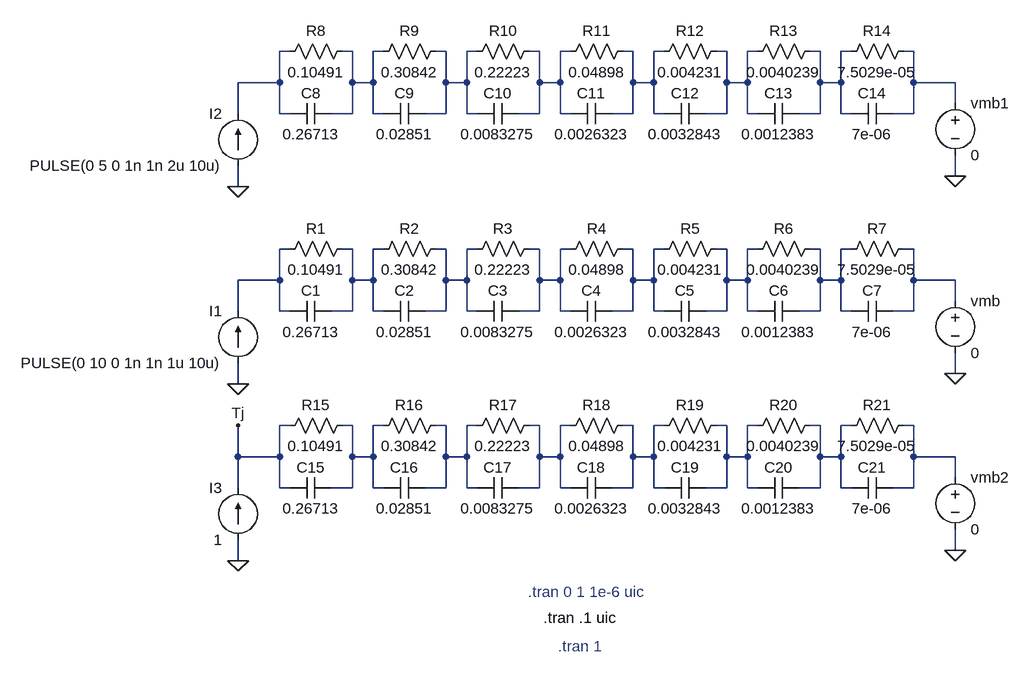
[diagram p0: schematic foster_test.asc]
foster_test.asc, the LTspice schematic file:
Version 4
SHEET 1 1228 1160
WIRE 48 112 32 112
WIRE 144 112 128 112
WIRE 192 112 176 112
WIRE 288 112 272 112
WIRE 336 112 320 112
WIRE 432 112 416 112
WIRE 480 112 464 112
WIRE 576 112 560 112
WIRE 624 112 608 112
WIRE 720 112 704 112
WIRE 768 112 752 112
WIRE 864 112 848 112
WIRE 912 112 896 112
WIRE 1008 112 992 112
WIRE 32 160 32 112
WIRE 32 160 -32 160
WIRE 144 160 144 112
WIRE 176 160 176 112
WIRE 176 160 144 160
WIRE 288 160 288 112
WIRE 320 160 320 112
WIRE 320 160 288 160
WIRE 432 160 432 112
WIRE 464 160 464 112
WIRE 464 160 432 160
WIRE 576 160 576 112
WIRE 608 160 608 112
WIRE 608 160 576 160
WIRE 720 160 720 112
WIRE 752 160 752 112
WIRE 752 160 720 160
WIRE 864 160 864 112
WIRE 896 160 896 112
WIRE 896 160 864 160
WIRE 1008 160 1008 112
WIRE 1072 160 1008 160
WIRE 1072 192 1072 160
WIRE -32 208 -32 160
WIRE 32 208 32 160
WIRE 48 208 32 208
WIRE 144 208 144 160
WIRE 144 208 112 208
WIRE 176 208 176 160
WIRE 192 208 176 208
WIRE 288 208 288 160
WIRE 288 208 256 208
WIRE 320 208 320 160
WIRE 336 208 320 208
WIRE 432 208 432 160
WIRE 432 208 400 208
WIRE 464 208 464 160
WIRE 480 208 464 208
WIRE 576 208 576 160
WIRE 576 208 544 208
WIRE 608 208 608 160
WIRE 624 208 608 208
WIRE 720 208 720 160
WIRE 720 208 688 208
WIRE 752 208 752 160
WIRE 768 208 752 208
WIRE 864 208 864 160
WIRE 864 208 832 208
WIRE 896 208 896 160
WIRE 912 208 896 208
WIRE 1008 208 1008 160
WIRE 1008 208 976 208
WIRE 1072 304 1072 272
WIRE -32 320 -32 288
WIRE 48 416 32 416
WIRE 144 416 128 416
WIRE 192 416 176 416
WIRE 288 416 272 416
WIRE 336 416 320 416
WIRE 432 416 416 416
WIRE 480 416 464 416
WIRE 576 416 560 416
WIRE 624 416 608 416
WIRE 720 416 704 416
WIRE 768 416 752 416
WIRE 864 416 848 416
WIRE 912 416 896 416
WIRE 1008 416 992 416
WIRE 32 464 32 416
WIRE 32 464 -32 464
WIRE 144 464 144 416
WIRE 176 464 176 416
WIRE 176 464 144 464
WIRE 288 464 288 416
WIRE 320 464 320 416
WIRE 320 464 288 464
WIRE 432 464 432 416
WIRE 464 464 464 416
WIRE 464 464 432 464
WIRE 576 464 576 416
WIRE 608 464 608 416
WIRE 608 464 576 464
WIRE 720 464 720 416
WIRE 752 464 752 416
WIRE 752 464 720 464
WIRE 864 464 864 416
WIRE 896 464 896 416
WIRE 896 464 864 464
WIRE 1008 464 1008 416
WIRE 1072 464 1008 464
WIRE 1072 496 1072 464
WIRE -32 512 -32 464
WIRE 32 512 32 464
WIRE 48 512 32 512
WIRE 144 512 144 464
WIRE 144 512 112 512
WIRE 176 512 176 464
WIRE 192 512 176 512
WIRE 288 512 288 464
WIRE 288 512 256 512
WIRE 320 512 320 464
WIRE 336 512 320 512
WIRE 432 512 432 464
WIRE 432 512 400 512
WIRE 464 512 464 464
WIRE 480 512 464 512
WIRE 576 512 576 464
WIRE 576 512 544 512
WIRE 608 512 608 464
WIRE 624 512 608 512
WIRE 720 512 720 464
WIRE 720 512 688 512
WIRE 752 512 752 464
WIRE 768 512 752 512
WIRE 864 512 864 464
WIRE 864 512 832 512
WIRE 896 512 896 464
WIRE 912 512 896 512
WIRE 1008 512 1008 464
WIRE 1008 512 976 512
WIRE 1072 608 1072 576
WIRE -32 624 -32 592
WIRE 48 688 32 688
WIRE 144 688 128 688
WIRE 192 688 176 688
WIRE 288 688 272 688
WIRE 336 688 320 688
WIRE 432 688 416 688
WIRE 480 688 464 688
WIRE 576 688 560 688
WIRE 624 688 608 688
WIRE 720 688 704 688
WIRE 768 688 752 688
WIRE 864 688 848 688
WIRE 912 688 896 688
WIRE 1008 688 992 688
WIRE -32 736 -32 688
WIRE 32 736 32 688
WIRE 32 736 -32 736
WIRE 144 736 144 688
WIRE 176 736 176 688
WIRE 176 736 144 736
WIRE 288 736 288 688
WIRE 320 736 320 688
WIRE 320 736 288 736
WIRE 432 736 432 688
WIRE 464 736 464 688
WIRE 464 736 432 736
WIRE 576 736 576 688
WIRE 608 736 608 688
WIRE 608 736 576 736
WIRE 720 736 720 688
WIRE 752 736 752 688
WIRE 752 736 720 736
WIRE 864 736 864 688
WIRE 896 736 896 688
WIRE 896 736 864 736
WIRE 1008 736 1008 688
WIRE 1072 736 1008 736
WIRE 1072 768 1072 736
WIRE -32 784 -32 736
WIRE 32 784 32 736
WIRE 48 784 32 784
WIRE 144 784 144 736
WIRE 144 784 112 784
WIRE 176 784 176 736
WIRE 192 784 176 784
WIRE 288 784 288 736
WIRE 288 784 256 784
WIRE 320 784 320 736
WIRE 336 784 320 784
WIRE 432 784 432 736
WIRE 432 784 400 784
WIRE 464 784 464 736
WIRE 480 784 464 784
WIRE 576 784 576 736
WIRE 576 784 544 784
WIRE 608 784 608 736
WIRE 624 784 608 784
WIRE 720 784 720 736
WIRE 720 784 688 784
WIRE 752 784 752 736
WIRE 768 784 752 784
WIRE 864 784 864 736
WIRE 864 784 832 784
WIRE 896 784 896 736
WIRE 912 784 896 784
WIRE 1008 784 1008 736
WIRE 1008 784 976 784
WIRE 1072 880 1072 848
WIRE -32 896 -32 864
FLAG 1072 608 0
FLAG -32 624 0
FLAG 1072 304 0
FLAG -32 320 0
FLAG 1072 880 0
FLAG -32 896 0
FLAG -32 688 Tj
SYMBOL res 32 432 R270
WINDOW 0 32 56 VTop 2
WINDOW 3 0 56 VBottom 2
SYMATTR InstName R1
SYMATTR Value 0.10491
SYMBOL res 176 432 R270
WINDOW 0 32 56 VTop 2
WINDOW 3 0 56 VBottom 2
SYMATTR InstName R2
SYMATTR Value 0.30842
SYMBOL res 320 432 R270
WINDOW 0 32 56 VTop 2
WINDOW 3 0 56 VBottom 2
SYMATTR InstName R3
SYMATTR Value 0.22223
SYMBOL res 464 432 R270
WINDOW 0 32 56 VTop 2
WINDOW 3 0 56 VBottom 2
SYMATTR InstName R4
SYMATTR Value 0.04898
SYMBOL res 608 432 R270
WINDOW 0 32 56 VTop 2
WINDOW 3 0 56 VBottom 2
SYMATTR InstName R5
SYMATTR Value 0.004231
SYMBOL res 752 432 R270
WINDOW 0 32 56 VTop 2
WINDOW 3 0 56 VBottom 2
SYMATTR InstName R6
SYMATTR Value 0.0040239
SYMBOL res 896 432 R270
WINDOW 0 32 56 VTop 2
WINDOW 3 0 56 VBottom 2
SYMATTR InstName R7
SYMATTR Value 7.5029e-05
SYMBOL cap 48 528 R270
WINDOW 0 32 32 VTop 2
WINDOW 3 0 32 VBottom 2
SYMATTR InstName C1
SYMATTR Value 0.26713
SYMBOL cap 192 528 R270
WINDOW 0 32 32 VTop 2
WINDOW 3 0 32 VBottom 2
SYMATTR InstName C2
SYMATTR Value 0.02851
SYMBOL cap 336 528 R270
WINDOW 0 32 32 VTop 2
WINDOW 3 0 32 VBottom 2
SYMATTR InstName C3
SYMATTR Value 0.0083275
SYMBOL cap 480 528 R270
WINDOW 0 32 32 VTop 2
WINDOW 3 0 32 VBottom 2
SYMATTR InstName C4
SYMATTR Value 0.0026323
SYMBOL cap 624 528 R270
WINDOW 0 32 32 VTop 2
WINDOW 3 0 32 VBottom 2
SYMATTR InstName C5
SYMATTR Value 0.0032843
SYMBOL cap 768 528 R270
WINDOW 0 32 32 VTop 2
WINDOW 3 0 32 VBottom 2
SYMATTR InstName C6
SYMATTR Value 0.0012383
SYMBOL cap 912 528 R270
WINDOW 0 32 32 VTop 2
WINDOW 3 0 32 VBottom 2
SYMATTR InstName C7
SYMATTR Value 7e-06
SYMBOL current -32 592 R180
WINDOW 0 24 80 Left 2
WINDOW 3 24 0 Left 2
WINDOW 123 0 0 Left 0
WINDOW 39 0 0 Left 0
SYMATTR InstName I1
SYMATTR Value PULSE(0 10 0 1n 1n 1u 10u)
SYMBOL voltage 1072 480 R0
SYMATTR InstName vmb
SYMATTR Value 0
SYMBOL res 32 128 R270
WINDOW 0 32 56 VTop 2
WINDOW 3 0 56 VBottom 2
SYMATTR InstName R8
SYMATTR Value 0.10491
SYMBOL res 176 128 R270
WINDOW 0 32 56 VTop 2
WINDOW 3 0 56 VBottom 2
SYMATTR InstName R9
SYMATTR Value 0.30842
SYMBOL res 320 128 R270
WINDOW 0 32 56 VTop 2
WINDOW 3 0 56 VBottom 2
SYMATTR InstName R10
SYMATTR Value 0.22223
SYMBOL res 464 128 R270
WINDOW 0 32 56 VTop 2
WINDOW 3 0 56 VBottom 2
SYMATTR InstName R11
SYMATTR Value 0.04898
SYMBOL res 608 128 R270
WINDOW 0 32 56 VTop 2
WINDOW 3 0 56 VBottom 2
SYMATTR InstName R12
SYMATTR Value 0.004231
SYMBOL res 752 128 R270
WINDOW 0 32 56 VTop 2
WINDOW 3 0 56 VBottom 2
SYMATTR InstName R13
SYMATTR Value 0.0040239
SYMBOL res 896 128 R270
WINDOW 0 32 56 VTop 2
WINDOW 3 0 56 VBottom 2
SYMATTR InstName R14
SYMATTR Value 7.5029e-05
SYMBOL cap 48 224 R270
WINDOW 0 32 32 VTop 2
WINDOW 3 0 32 VBottom 2
SYMATTR InstName C8
SYMATTR Value 0.26713
SYMBOL cap 192 224 R270
WINDOW 0 32 32 VTop 2
WINDOW 3 0 32 VBottom 2
SYMATTR InstName C9
SYMATTR Value 0.02851
SYMBOL cap 336 224 R270
WINDOW 0 32 32 VTop 2
WINDOW 3 0 32 VBottom 2
SYMATTR InstName C10
SYMATTR Value 0.0083275
SYMBOL cap 480 224 R270
WINDOW 0 32 32 VTop 2
WINDOW 3 0 32 VBottom 2
SYMATTR InstName C11
SYMATTR Value 0.0026323
SYMBOL cap 624 224 R270
WINDOW 0 32 32 VTop 2
WINDOW 3 0 32 VBottom 2
SYMATTR InstName C12
SYMATTR Value 0.0032843
SYMBOL cap 768 224 R270
WINDOW 0 32 32 VTop 2
WINDOW 3 0 32 VBottom 2
SYMATTR InstName C13
SYMATTR Value 0.0012383
SYMBOL cap 912 224 R270
WINDOW 0 32 32 VTop 2
WINDOW 3 0 32 VBottom 2
SYMATTR InstName C14
SYMATTR Value 7e-06
SYMBOL current -32 288 R180
WINDOW 0 24 80 Left 2
WINDOW 3 24 0 Left 2
WINDOW 123 0 0 Left 0
WINDOW 39 0 0 Left 0
SYMATTR InstName I2
SYMATTR Value PULSE(0 5 0 1n 1n 2u 10u)
SYMBOL voltage 1072 176 R0
SYMATTR InstName vmb1
SYMATTR Value 0
SYMBOL res 32 704 R270
WINDOW 0 32 56 VTop 2
WINDOW 3 0 56 VBottom 2
SYMATTR InstName R15
SYMATTR Value 0.10491
SYMBOL res 176 704 R270
WINDOW 0 32 56 VTop 2
WINDOW 3 0 56 VBottom 2
SYMATTR InstName R16
SYMATTR Value 0.30842
SYMBOL res 320 704 R270
WINDOW 0 32 56 VTop 2
WINDOW 3 0 56 VBottom 2
SYMATTR InstName R17
SYMATTR Value 0.22223
SYMBOL res 464 704 R270
WINDOW 0 32 56 VTop 2
WINDOW 3 0 56 VBottom 2
SYMATTR InstName R18
SYMATTR Value 0.04898
SYMBOL res 608 704 R270
WINDOW 0 32 56 VTop 2
WINDOW 3 0 56 VBottom 2
SYMATTR InstName R19
SYMATTR Value 0.004231
SYMBOL res 752 704 R270
WINDOW 0 32 56 VTop 2
WINDOW 3 0 56 VBottom 2
SYMATTR InstName R20
SYMATTR Value 0.0040239
SYMBOL res 896 704 R270
WINDOW 0 32 56 VTop 2
WINDOW 3 0 56 VBottom 2
SYMATTR InstName R21
SYMATTR Value 7.5029e-05
SYMBOL cap 48 800 R270
WINDOW 0 32 32 VTop 2
WINDOW 3 0 32 VBottom 2
SYMATTR InstName C15
SYMATTR Value 0.26713
SYMBOL cap 192 800 R270
WINDOW 0 32 32 VTop 2
WINDOW 3 0 32 VBottom 2
SYMATTR InstName C16
SYMATTR Value 0.02851
SYMBOL cap 336 800 R270
WINDOW 0 32 32 VTop 2
WINDOW 3 0 32 VBottom 2
SYMATTR InstName C17
SYMATTR Value 0.0083275
SYMBOL cap 480 800 R270
WINDOW 0 32 32 VTop 2
WINDOW 3 0 32 VBottom 2
SYMATTR InstName C18
SYMATTR Value 0.0026323
SYMBOL cap 624 800 R270
WINDOW 0 32 32 VTop 2
WINDOW 3 0 32 VBottom 2
SYMATTR InstName C19
SYMATTR Value 0.0032843
SYMBOL cap 768 800 R270
WINDOW 0 32 32 VTop 2
WINDOW 3 0 32 VBottom 2
SYMATTR InstName C20
SYMATTR Value 0.0012383
SYMBOL cap 912 800 R270
WINDOW 0 32 32 VTop 2
WINDOW 3 0 32 VBottom 2
SYMATTR InstName C21
SYMATTR Value 7e-06
SYMBOL current -32 864 R180
WINDOW 0 24 80 Left 2
WINDOW 3 24 0 Left 2
WINDOW 123 0 0 Left 0
WINDOW 39 0 0 Left 0
SYMATTR InstName I3
SYMATTR Value 1
SYMBOL voltage 1072 752 R0
SYMATTR InstName vmb2
SYMATTR Value 0
TEXT 414 944 Left 2 ;.tran 0 1 1e-6 uic
TEXT 438 984 Left 2 !.tran .1 uic
TEXT 460 1028 Left 2 ;.tran 1

The netlist it stands for:
* foster_test.asc
R1 N009 N010 0.10491
R2 N010 N011 0.30842
R3 N011 N012 0.22223
R4 N012 N013 0.04898
R5 N013 N014 0.004231
R6 N014 N015 0.0040239
R7 N015 N016 7.5029e-05
C1 N009 N010 0.26713
C2 N010 N011 0.02851
C3 N011 N012 0.0083275
C4 N012 N013 0.0026323
C5 N013 N014 0.0032843
C6 N014 N015 0.0012383
C7 N015 N016 7e-06
I1 0 N009 PULSE(0 10 0 1n 1n 1u 10u)
vmb N016 0 0
R8 N001 N002 0.10491
R9 N002 N003 0.30842
R10 N003 N004 0.22223
R11 N004 N005 0.04898
R12 N005 N006 0.004231
R13 N006 N007 0.0040239
R14 N007 N008 7.5029e-05
C8 N001 N002 0.26713
C9 N002 N003 0.02851
C10 N003 N004 0.0083275
C11 N004 N005 0.0026323
C12 N005 N006 0.0032843
C13 N006 N007 0.0012383
C14 N007 N008 7e-06
I2 0 N001 PULSE(0 5 0 1n 1n 2u 10u)
vmb1 N008 0 0
R15 Tj N017 0.10491
R16 N017 N018 0.30842
R17 N018 N019 0.22223
R18 N019 N020 0.04898
R19 N020 N021 0.004231
R20 N021 N022 0.0040239
R21 N022 N023 7.5029e-05
C15 Tj N017 0.26713
C16 N017 N018 0.02851
C17 N018 N019 0.0083275
C18 N019 N020 0.0026323
C19 N020 N021 0.0032843
C20 N021 N022 0.0012383
C21 N022 N023 7e-06
I3 0 Tj 1
vmb2 N023 0 0
* .tran 0 1 1e-6 uic
.tran .1 uic
* .tran 1
.backanno
.end